# EasyEDA Pro project FKM3.epro, board FIRST_LAYOUT_TEST
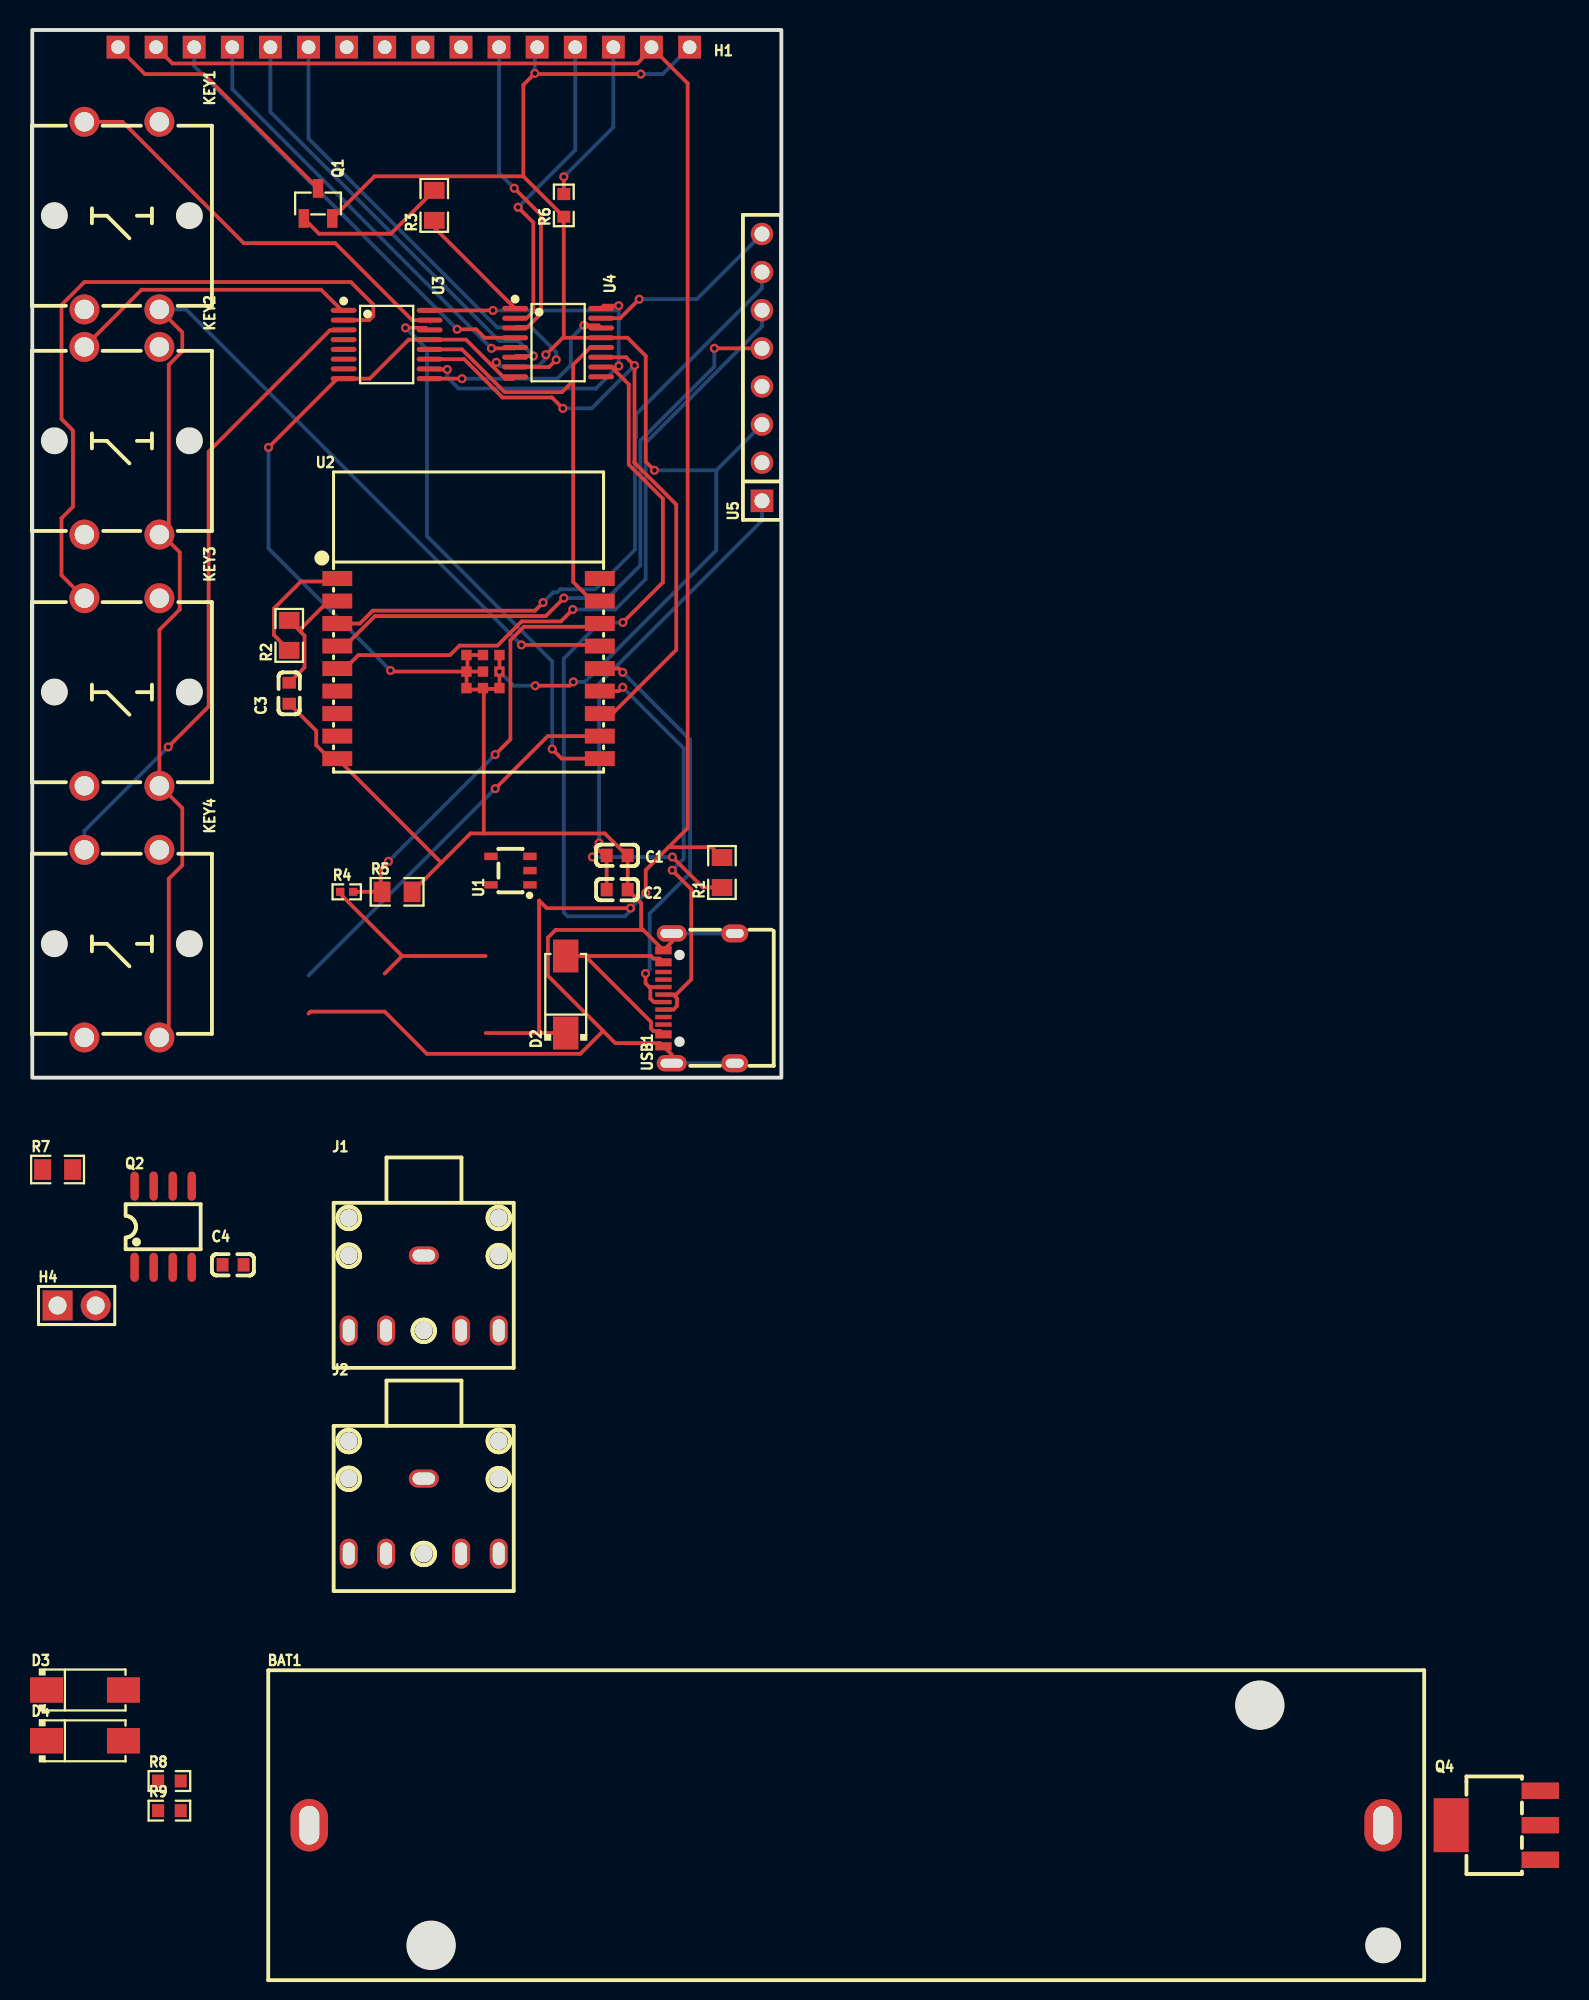
[diagram p9: board, top side]
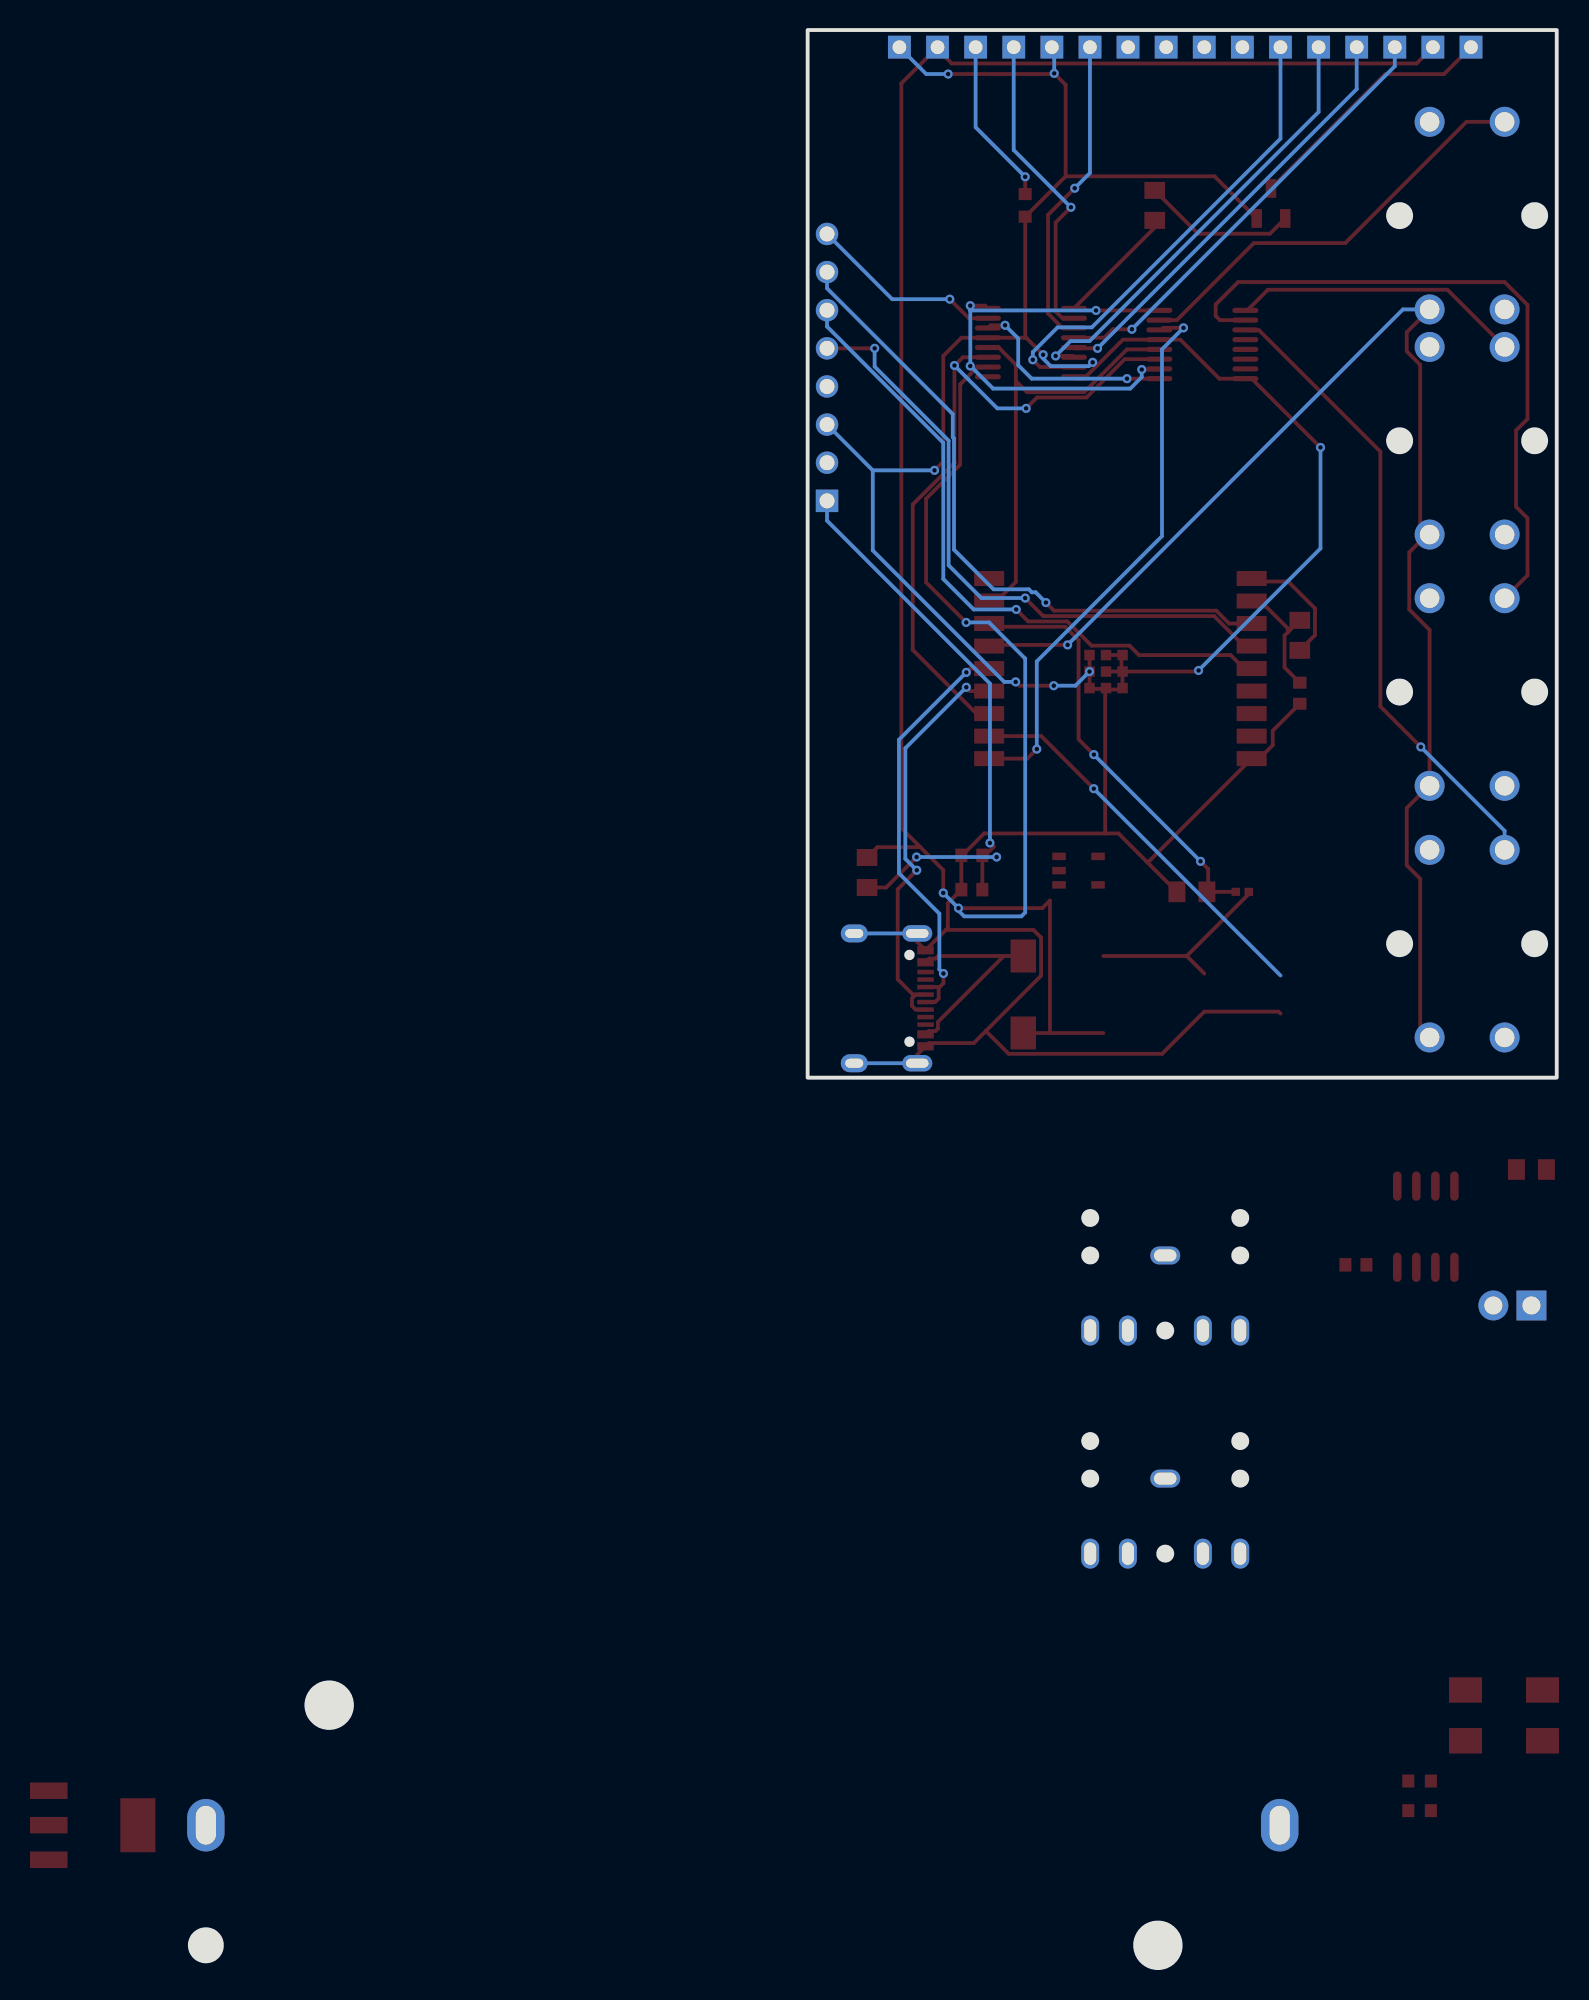
[diagram p10: board, bottom side, seen from below]

Outline 91.24 x 129.26 mm; copper layers: Top Layer, Bottom Layer. Coordinates in mm from the lower left corner of the outline.
Outline path: rectangle 0,129.26 49.93,59.45
Stack: Top Layer 0.035mm / Dielectric1 1.51mm FR4 er 4.5 / Bottom Layer 0.035mm

## Design rules (mm)
template: JLCPCB Capability(Two Layers Board)
spacing copperThickness1oz (default): track to track 0.102, other pairs 0.152 to 0.3
spacing copperThickness2oz: track to track 0.203, other pairs 0.152 to 0.3
track width copperThickness1oz (default): min 0.127, default 0.254, max 2.54
track width copperThickness2oz: min 0.203, default 0.254, max 2.54
differential pair differentialPair (default): width min 0.127, default 0.254, max 2.54; gap min 0.152, default 0.152
via viaSize (default): diameter min 0.5, default 0.61, max 10; hole min 0.3, default 0.305, max 6.3

## Placement (name value [footprint] x y rotation side)
BAT1  BH-18650-A6AJ003  [BAT-TH_BH-18650-A5BJ003]  54.26 9.64 0 top
C1  10uF  [C0603]  38.99 74.26 0 top
C2  100nF  [C0603]  38.99 71.98 0 top
C3  1uF  [C0603]  17.13 85.07 90 top
C4  10uF  [C0603]  13.39 46.98 0 top
D2  SS14  [SMA_L4.2-W2.6-LS5.3-RD]  35.56 64.99 90 top
D3  SS14  [SMA_L4.2-W2.6-LS5.3-RD]  3.52 18.65 0 top
D4  SS14  [SMA_L4.2-W2.6-LS5.3-RD]  3.52 15.27 0 top
H1  -  [LCD16x2 edge connector]  43.81 128.11 180 top
H4  PW SWITCH  [HDR-TH_2P-P2.54-V-M]  2.96 44.27 0 top
J1  PJ-307C  [AUDIO-TH_PJ307C]  26.1 45.1 0 top
J2  PJ-307C  [AUDIO-TH_PJ307C]  26.1 30.24 0 top
KEY1  B3F-4055  [KEY-TH_4P-L12.0-W12.0-P5.00-LS13.4-EH]  5.97 116.89 270 top
KEY2  B3F-4055  [KEY-TH_4P-L12.0-W12.0-P5.00-LS13.4-EH]  5.97 101.89 270 top
KEY3  B3F-4055  [KEY-TH_4P-L12.0-W12.0-P5.00-LS13.4-EH]  5.97 85.15 270 top
KEY4  B3F-4055  [KEY-TH_4P-L12.0-W12.0-P5.00-LS13.4-EH]  5.97 68.38 270 top
Q1  MMBT3904  [SOT-23-3_L2.9-W1.3-P1.90-LS2.4-BR]  19.05 117.7 270 top
Q2  AOSP21321  [SOIC-8_L5.0-W4.0-P1.27-LS6.0-BL]  8.73 49.52 0 top
Q4  YJM04N10A  [SOT-223_L6.3-W3.5-P2.30-LS7.0-BR-1]  97.55 9.64 0 top
R1  10kΩ  [R0805]  45.97 73.12 90 top
R2  10kΩ  [R0805]  17.13 88.92 90 top
R3  10kΩ  [R0805]  26.8 117.57 90 top
R4  6.8kΩ  [R0402]  20.96 71.83 0 top
R5  10kΩ  [R0805]  24.32 71.83 0 top
R6  2200  [R0603]  35.43 117.57 90 top
R7  10kΩ  [R0805]  1.69 53.33 0 top
R8  5100  [R0603]  9.14 12.59 0 top
R9  5100  [R0603]  9.14 10.62 0 top
U1  AP7366-33W5-7  [SOT-25_L3.0-W1.6-P0.95-LS2.8-BL]  31.88 73.25 90 top
U2  2.4GHz  [BULETM-SMD_ESPRESSIF_ESP32-C3-WROOM-02-N4-4MB]  29.08 86.71 0 top
U3  74HC595PW,118  [TSSOP-16_L5.0-W4.4-P0.65-LS6.4-BL]  23.62 108.3 270 top
U4  74HC595PW,118  [TSSOP-16_L5.0-W4.4-P0.65-LS6.4-BL]  35.05 108.43 270 top
U5  RFID  [HDR-TH_8P-P2.54-V-M]  48.64 106.78 90 top
USB1  TYPE-C 16PIN 2MD(073)  [USB-C-SMD_TYPE-C-6PIN-2MD-073]  44.45 64.74 90 top

## Footprints (pads in the part's own frame, mm; a bottom-side part is the same pattern mirrored in y, then rotated)
AUDIO-TH_PJ307C
  oval 2x1.2 hole 1.5x0.8: 1(0,2.5)
  oval 1.2x2 hole 0.8x1.5: 2(5,-2.5) 3(2.489,-2.5) 4(-2.511,-2.5) 5(-5,-2.5)
BAT-TH_BH-18650-A5BJ003
  oval 2.5x3.5 hole 1.34x2.58: 1(-35.79,0) 2(35.79,0)
BULETM-SMD_ESPRESSIF_ESP32-C3-WROOM-02-N4-4MB
  rect 2x1 smd: 1(-8.75,6) 2(-8.75,4.5) 3(-8.75,3) 4(-8.75,1.5) 5(-8.75,0) 6(-8.75,-1.5) 7(-8.75,-3) 8(-8.75,-4.5) 9(-8.75,-6) 10(8.75,-6) 11(8.75,-4.5) 12(8.75,-3) 13(8.75,-1.5) 14(8.75,0) 15(8.75,1.5) 16(8.75,3) 17(8.75,4.5) 18(8.75,6)
  rect 0.7x0.7 smd: 19(-0.14,0.9) 19(-0.14,-0.2) 19(-0.14,-1.3) 19(0.96,0.9) 19(0.96,-0.2) 19(0.96,-1.3) 19(2.06,0.9) 19(2.06,-0.2) 19(2.06,-1.3)
C0603
  rect 0.8x0.9 smd: 1(-0.7,0) 2(0.7,0)
HDR-TH_2P-P2.54-V-M
  rect 2x2 hole 1.2: 1(-1.27,0)
  round 2 hole 1.2: 2(1.27,0)
HDR-TH_8P-P2.54-V-M
  rect 1.5x1.5 hole 1: 1(-8.89,0)
  round 1.5 hole 1: 2(-6.35,0) 3(-3.81,0) 4(-1.27,0) 5(1.27,0) 6(3.81,0) 7(6.35,0) 8(8.89,0)
KEY-TH_4P-L12.0-W12.0-P5.00-LS13.4-EH
  round 2 hole 1.3: 1(6.25,-2.5) 2(-6.25,-2.5) 3(6.25,2.5) 4(-6.25,2.5)
LCD16x2 edge connector
  rect 1.524x1.524 hole 0.914x0.914: 1(0,0) 3(5.08,0) 4(7.62,0) 5(10.16,0) 6(12.7,0) 7(15.24,0) 8(17.78,0) 9(20.32,0) 10(22.86,0) 11(25.4,0) 12(27.94,0) 13(30.48,0) 14(33.02,0) 15(35.56,0) 16(38.1,0)
  rect 1.524x1.524 hole 0.914x1: 2(2.54,0)
R0402
  rect 0.566x0.54 smd: 1(-0.433,0) 2(0.433,0)
R0603
  rect 0.806x0.864 smd: 1(-0.753,0) 2(0.753,0)
R0805
  rect 1.133x1.377 smd: 1(-1,0) 2(1,0)
SMA_L4.2-W2.6-LS5.3-RD
  rect 2.2x1.7 smd: 1(-2.566,0) 2(2.566,0)
SOIC-8_L5.0-W4.0-P1.27-LS6.0-BL
  oval 0.569x1.95 smd: 1(-1.905,-2.705) 2(-0.635,-2.705) 3(0.635,-2.705) 4(1.905,-2.705) 5(1.905,2.705) 6(0.635,2.705) 7(-0.635,2.705) 8(-1.905,2.705)
SOT-23-3_L2.9-W1.3-P1.90-LS2.4-BR
  rect 1.25x0.7 smd: 1(1,-0.95) 2(1,0.95) 3(-1,0)
SOT-25_L3.0-W1.6-P0.95-LS2.8-BL
  rect 0.5x0.9 smd: 1(-0.95,-1.3) 2(0,-1.3) 3(0.95,-1.3) 4(0.95,1.3) 5(-0.95,1.3)
SOT-223_L6.3-W3.5-P2.30-LS7.0-BR-1
  rect 2.5x1.1 smd: 1(2.97,-2.3) 2(2.97,0) 3(2.97,2.3)
  rect 2.34x3.6 smd: 4(-2.97,0)
TSSOP-16_L5.0-W4.4-P0.65-LS6.4-BL
  oval 0.343x1.732 smd: 1(-2.275,-2.866) 2(-1.625,-2.866) 3(-0.975,-2.866) 4(-0.325,-2.866) 5(0.325,-2.866) 6(0.975,-2.866) 7(1.625,-2.866) 8(2.275,-2.866) 9(2.275,2.866) 10(1.625,2.866) 11(0.975,2.866) 12(0.325,2.866) 13(-0.325,2.866) 14(-0.975,2.866) 15(-1.625,2.866) 16(-2.275,2.866)
USB-C-SMD_TYPE-C-6PIN-2MD-073
  rect 0.55x1.1 smd: 1(-3.2,2.375) 2(-2.4,2.375) 11(2.4,2.375) 12(3.2,2.375)
  rect 0.3x1.1 smd: 3(-1.75,2.375) 4(-1.25,2.375) 5(-0.75,2.375) 6(-0.25,2.375) 7(0.25,2.375) 8(0.75,2.375) 9(1.25,2.375) 10(1.75,2.375)
  oval 1.1x2 hole 0.6x1.5: 13(-4.325,1.825) 14(4.325,1.825)
  oval 1.2x1.8 hole 0.6x1.2: 13(-4.325,-2.375) 14(4.325,-2.375)

## Nets
GND: C1.2 C2.2 C3.1 C4.2 H1.1 H1.5 J1.1 J2.1 Q1.2 Q4.3 R5.2 R6.1 R8.1 R9.1 U1.2 U2.9 U2.19 U3.8 U3.13 U4.8 U4.13 U5.3 USB1.1 USB1.12 USB1.13 USB1.14
VBAT: BAT1.2 Q2.5 Q2.6 Q2.7 Q2.8 R4.1
VBUS: C4.1 H1.2 H1.15 H4.1 Q4.1 R1.2 U1.1 U3.10 U3.16 U4.10 U4.16
VCC: C1.1 C2.1 R2.1 U1.5 U2.1 U5.1
BAT_SENS: R4.2 R5.1 U2.16
BTN_1: KEY1.2 U3.15
BTN_2: KEY2.2 U3.1
BTN_3: KEY3.2 U3.2
BTN_4: KEY4.2 U3.3
BTN_INP: KEY1.3 KEY2.3 KEY3.3 KEY4.3 U2.15
JACK: J1.4 J1.5 J2.4 J2.5 U2.11
LCD_BL: R3.1 U4.1
LCD_BLK: H1.16 Q1.3
LCD_D4: H1.11 U4.7
LCD_D5: H1.12 U4.6
LCD_D6: H1.13 U4.5
LCD_D7: H1.14 U4.4
LCD_E: H1.6 U4.3
LCD_RS: H1.4 U4.2
S_DS: U2.10 U3.14
S_OUT: U4.9
S_SHCP: U2.12 U3.11 U4.11
S_STCP: U2.17 U3.12 U4.12
SPI_CS: U4.15 U5.8
SPI_MISO: U2.4 U5.5
SPI_MOSI: U2.5 U5.6
SPI_SCK: U2.3 U5.7
USB_D+: U2.14 USB1.6 USB1.8
USB_D-: U2.13 USB1.5 USB1.7
VUSB: D2.2 R7.1 USB1.2 USB1.11
$1N383: R1.1 U1.3
$1N953: C3.2 R2.2 U2.2
$1N2900: Q1.1 R3.2
$1N7305: U3.9 U4.14
$1N10592: D4.1 H4.2 Q2.1 Q2.2 Q2.3
$1N10672: Q2.4 R7.2
$1N12803: D3.1 D4.2
$1N12805: D2.1 D3.2
$1N12994: R8.2 USB1.4
$1N13053: R9.2 USB1.10
$2N1616: H1.3 R6.2
$2N2604: BAT1.1 Q4.2 Q4.4

Pads without a net: H1 7 8 9 10; J1 2 3; J2 2 3; KEY1 1 4; KEY2 1 4; KEY3 1 4; KEY4 1 4; U1 4; U2 6 7 8 18; U3 4 5 6 7; U5 2 4; USB1 3 9

## Via types
v1: diameter 0.61, hole 0.305, Top Layer to Bottom Layer, 47 vias

## Routing (per net, layer and track width the routed paths; a pad name or vN(x,y) marks a point on that pad's centre or on a via; arc(x,y) is an arc through that point)
GND: length 250.7
  Top Layer w0.254: 28.94,86.51 23.95,86.51 v1(23.88,86.58) ; U2.19 U2.19 29.01,87.54 29.01,86.51 30.04,86.51 ; 35.43,108.75 35.37,108.75 v1(34.24,107.62) ; 35.43,108.75 35.43,116.81 32.74,119.51 ; 35.43,108.75 39.68,108.75 40.89,107.54 40.89,100.5 v1(41.47,99.92) ; 30.1,75.73 29.21,75.73 27.28,73.79 ; 30.1,75.73 38.17,75.73 39.69,74.2 ; 30.1,75.73 30.1,85.31 ; 27.28,73.79 R5.2 ; 27.28,73.79 27.25,73.79 U2.9 19.82,80.71 18.93,81.61 18.93,82.57 C3.1 ; 28.95,85.4 29.04,85.31 30.1,85.31 ; 28.95,85.4 U2.19 ; 28.95,85.4 28.95,86.5 ; U2.19 v1(31.14,86.51) U2.19 31.09,85.35 30.1,85.35 ; 30.1,85.31 30.1,85.35 ; 30.1,85.35 U2.19 ; 40.72,69.29 34.88,69.29 34.37,68.78 34.37,66.24 38.05,62.56 ; 40.72,69.29 USB1.12 42.62,68.49 USB1.14 ; 40.72,69.29 40.59,69.43 40.59,71.08 C2.2 39.69,74.2 ; v1(15.75,101.44) 20.33,106.03 22.49,106.03 25.09,108.63 28.91,108.63 30.68,106.86 ; 39.69,74.2 C1.2 ; 38.05,62.56 36.53,61.04 26.31,61.04 23.49,63.85 18.54,63.85 18.41,63.72 ; 38.05,62.56 38.86,61.75 41.86,61.75 USB1.1 42.62,60.99 USB1.13 ; 33.45,126.32 32.74,125.6 32.74,119.51 ; 33.45,126.32 v1(40.57,126.32) ; 33.45,126.32 v1(33.5,126.37) ; v1(33.53,85.57) 35.81,85.57 v1(36.07,85.82) ; 30.68,106.86 31.53,106.01 32.04,106.01 U4.8 ; 30.68,106.86 v1(30.93,107.11) ; 32.74,119.51 22.81,119.51 Q1.2
  Bottom Layer w0.254: USB1.14 USB1.14 ; v1(40.57,126.32) 42.03,126.32 H1.1 ; USB1.13 USB1.13 ; v1(41.47,99.92) 45.59,99.92 ; 45.59,99.92 U5.3 ; 45.59,99.92 45.59,94.58 36.83,85.82 v1(36.07,85.82) ; v1(33.53,85.57) 32.09,85.57 v1(31.14,86.51) ; v1(30.93,107.11) 31.19,106.86 33.73,106.86 34.24,107.37 v1(34.24,107.62) ; v1(15.75,101.44) 15.75,94.71 v1(23.88,86.58) ; v1(33.5,126.37) 33.5,127.96 H1.5
VBAT: length 13.2
  Top Layer w0.254: R4.1 20.53,71.69 24.66,67.56 ; 24.66,67.56 23.49,66.39 ; 24.66,67.56 30.23,67.56
VCC: length 39.3
  Top Layer w0.254: U2.1 20.13,92.51 17.91,92.51 16.11,90.72 16.11,88.94 R2.1 ; 38.29,74.07 C2.1 ; 38.29,74.07 37.53,74.84 v1(37.78,75.09) ; 38.29,74.07 C1.1
  Bottom Layer w0.254: U5.1 48.64,96.57 37.78,85.71 v1(37.78,75.09)
BAT_SENS: length 28.7
  Top Layer w0.254: v1(23.74,73.87) 23.23,73.36 23.23,71.83 ; 23.23,71.83 R5.1 ; 23.23,71.83 R4.2 ; v1(30.86,80.98) 31.87,81.99 31.87,88.6 32.77,89.5 37.62,89.5 U2.16
  Bottom Layer w0.254: v1(23.74,73.87) v1(30.86,80.98)
BTN_1: length 28.4
  Top Layer w0.254: KEY1.2 6.01,123.14 14.1,115.06 20.19,115.06 25.32,109.93 26.36,109.93
BTN_2: length 19.3
  Top Layer w0.254: KEY2.2 7.28,111.95 19.26,111.95 20.63,110.58
BTN_3: length 45.8
  Top Layer w0.254: KEY3.2 1.95,92.92 1.95,96.73 2.71,97.49 2.71,102.57 1.95,103.34 1.95,110.94 3.47,112.47 21.23,112.47 22.73,110.97 22.73,110.21 22.45,109.93 20.63,109.93
BTN_4: length 42.2
  Top Layer w0.254: v1(9.06,81.49) 11.76,84.18 11.76,101.17 19.84,109.25 20.6,109.25 20.63,109.28
  Bottom Layer w0.254: v1(9.06,81.49) 3.47,75.9 KEY4.2
BTN_INP: length 90.9
  Top Layer w0.254: 8.56,95.73 9.83,94.46 9.83,90.65 8.47,89.29 8.47,78.94 ; 8.56,95.73 KEY2.3 ; 8.56,95.73 9.1,96.27 9.1,106.95 10,107.85 10,109.12 KEY1.3 ; 8.47,78.94 KEY3.3 ; 8.47,78.94 10,77.42 10,73.61 9.1,72.71 9.1,62.76 KEY4.3 ; U2.15 37.76,88.29 v1(32.6,88.29)
  Bottom Layer w0.254: KEY1.3 10.25,110.64 v1(32.6,88.29)
JACK: length 26
  Top Layer w0.254: v1(30.86,78.71) 34.36,82.21 U2.11
  Bottom Layer w0.254: 18.41,66.26 v1(30.86,78.71)
LCD_BL: length 8.1
  Top Layer w0.254: R3.1 26.8,116.09 U4.1
LCD_BLK: length 17.2
  Top Layer w0.254: Q1.3 11.43,126.32 7.51,126.32 5.71,128.11
LCD_D4: length 31.9
  Top Layer w0.254: U4.7 34.44,106.8 v1(34.92,107.28)
  Bottom Layer w0.254: v1(34.92,107.28) 34.92,107.79 33.27,109.44 30.99,109.44 18.41,122.02 H1.11
LCD_D5: length 29.8
  Top Layer w0.254: 32.19,107.45 32.27,107.54 v1(33.4,107.54)
  Bottom Layer w0.254: v1(33.4,107.54) 32.41,108.53 31.14,108.53 15.88,123.79 H1.12
LCD_D6: length 28.8
  Top Layer w0.254: U4.5 32.13,108.05 v1(30.61,108.05)
  Bottom Layer w0.254: 13.33,128.11 13.33,125.32 v1(30.61,108.05)
LCD_D7: length 30.2
  Top Layer w0.254: v1(28.32,109.32) 29.59,109.32 30.15,108.75 32.19,108.75
  Bottom Layer w0.254: 10.79,128.11 10.79,126.84 v1(28.32,109.32)
LCD_E: length 21
  Top Layer w0.254: v1(32.13,118.71) 33.91,116.94 33.91,110.36 33.01,109.47 32.25,109.47 U4.3
  Bottom Layer w0.254: H1.6 31.11,119.73 v1(32.13,118.71)
LCD_RS: length 21
  Top Layer w0.254: 32.19,110.05 32.95,110.05 33.4,110.51 33.4,116.43 v1(32.39,117.44)
  Bottom Layer w0.254: H1.4 36.2,121.25 v1(32.39,117.44)
S_DS: length 37.1
  Top Layer w0.254: U2.10 35.29,80.71 v1(34.66,81.35) ; 26.36,109.28 26.22,109.41 v1(24.88,109.41)
  Bottom Layer w0.254: v1(34.66,81.35) 34.66,87.19 26.31,95.53 26.31,107.98 v1(24.88,109.41)
S_SHCP: length 45.6
  Top Layer w0.254: 37.92,107.45 39.58,107.45 40.13,106.9 v1(40.15,106.9) 40.15,100.47 40.12,100.45 42.93,97.64 42.93,87.96 38.68,83.71 U2.12 ; U3.11 28.79,107.33 31.35,104.77 34.65,104.77 v1(35.37,104.05)
  Bottom Layer w0.254: v1(40.15,106.9) 37.29,104.05 v1(35.37,104.05)
S_STCP: length 30.3
  Top Layer w0.254: 37.92,108.1 37.2,108.1 36.05,106.96 36.05,105.87 ; 26.36,107.98 28.65,107.98 31.5,105.13 35.31,105.13 36.05,105.87 ; 36.05,105.87 36.05,92.48 37.33,91.21 U2.17
SPI_CS: length 13
  Top Layer w0.254: 37.92,110.05 39.19,110.05 v1(40.46,111.32)
  Bottom Layer w0.254: U5.8 44.3,111.32 v1(40.46,111.32)
SPI_MISO: length 42.1
  Top Layer w0.254: v1(45.47,108.05) 48.64,108.05 ; U2.4 20.84,88.21 22.84,90.21 34.23,90.21 v1(35.43,91.41)
  Bottom Layer w0.254: v1(35.43,91.41) 38.35,91.41 40.53,93.59 40.53,101.9 45.47,106.83 v1(45.47,108.05)
SPI_MOSI: length 44.1
  Top Layer w0.254: U2.5 20.84,86.71 21.74,87.61 27.85,87.61 28.48,88.24 31.01,88.24 32.62,89.85 35.23,89.85 v1(36.03,90.65)
  Bottom Layer w0.254: U5.6 48.64,109.5 40.89,101.75 40.89,92.68 38.86,90.65 v1(36.03,90.65)
SPI_SCK: length 43.9
  Top Layer w0.254: U2.3 21.84,89.71 22.69,90.56 33.51,90.56 v1(34.05,91.11)
  Bottom Layer w0.254: U5.7 48.64,112.05 40.26,103.67 40.26,102.13 40.18,102.05 40.18,94.63 37.54,91.99 35.19,91.99 34.99,91.79 34.73,91.79 v1(34.05,91.11)
USB_D+: length 28.5
  Top Layer w0.254: USB1.6 41.44,64.49 41.2,64.73 41.2,65.49 ; 41.2,65.49 41.14,65.49 40.88,65.74 v1(40.88,66.39) ; 41.2,65.49 USB1.8 ; v1(39.36,86.46) 39.1,86.71 U2.14
  Bottom Layer w0.254: v1(39.36,86.46) 43.85,81.97 43.85,73.08 41.15,70.38 41.15,66.66 v1(40.88,66.39)
USB_D-: length 27.8
  Top Layer w0.254: 42.72,64.99 42.98,64.74 42.98,64.23 42.74,63.99 USB1.5 ; 42.72,64.99 USB1.7 ; 42.72,64.99 42.91,64.99 43.93,66.01 43.93,72 v1(42.66,73.27) ; U2.13 39.1,85.21 v1(39.36,85.46)
  Bottom Layer w0.254: v1(42.66,73.27) 43.42,74.03 43.42,81.4 v1(39.36,85.46)
VUSB: length 14.3
  Top Layer w0.254: 36.86,67.56 41.24,67.56 41.41,67.39 41.83,67.39 USB1.11 ; 36.86,67.56 41.25,63.17 41.25,62.72 41.41,62.56 41.85,62.56 USB1.2 ; 36.86,67.56 D2.2
$1N383: length 9.5
  Top Layer w0.254: R1.1 44.7,72.12 v1(42.67,74.15)
  Bottom Layer w0.254: v1(42.67,74.15) v1(37.34,74.15)
$1N953: length 8.4
  Top Layer w0.254: C3.2 18.14,86.78 18.14,88.91 17.92,89.13 ; U2.2 20.3,91.18 19.72,91.18 17.92,89.38 17.92,89.13 ; 17.92,89.13 R2.2
$1N2900: length 10.3
  Top Layer w0.254: R3.2 23.91,115.68 19.12,115.68 Q1.1
$1N7305: length 14.1
  Top Layer w0.254: 26.36,106.03 v1(28.65,106.03) ; v1(36.77,109.58) 37.74,109.58 37.92,109.4
  Bottom Layer w0.254: v1(28.65,106.03) 35,106.03 35.89,106.92 35.89,108.7 v1(36.77,109.58)
$1N12805: length 197.8
  Top Layer w0.254: v1(39.09,110.89) 38.1,110.89 37.92,110.7 ; v1(27.66,106.63) 26.4,106.63 26.36,106.68 ; 30.23,62.43 33.78,62.43 ; 33.78,62.43 D2.1 ; 33.78,62.43 33.78,71.25 34.29,70.75 v1(39.88,70.75) ; 41.34,128.04 43.69,125.7 43.69,76.08 42.42,74.81 ; 41.34,128.04 41.27,128.11 ; 41.34,128.04 40.33,127.03 9.34,127.03 8.25,128.11 ; v1(40.89,71.76) 40.89,73.29 42.42,74.81 ; 42.42,74.81 45.28,74.81 45.97,74.12 ; 37.92,106.8 38.61,106.8 38.84,106.57 ; 38.84,106.57 39.76,105.65 39.76,100.3 42.04,98.03 42.04,92.46 v1(39.37,89.78) ; 38.84,106.57 38.84,106.61 v1(39.09,106.87) ; v1(30.71,110.57) 26.36,110.57
  Bottom Layer w0.254: 39.09,106.89 37.57,105.36 28.42,105.36 27.66,106.13 v1(27.66,106.63) ; 39.09,106.89 39.09,110.57 ; 39.09,106.89 v1(39.09,106.87) ; 39.09,110.57 v1(39.09,110.89) ; 39.09,110.57 v1(30.71,110.57) ; v1(39.37,89.78) 37.84,89.78 35.43,87.38 35.43,70.45 35.69,70.2 39.5,70.2 39.88,70.58 v1(39.88,70.75) v1(40.89,71.76)
$2N1616: length 11.2
  Top Layer w0.254: v1(35.43,119.48) R6.2
  Bottom Layer w0.254: H1.3 38.73,122.78 v1(35.43,119.48)
